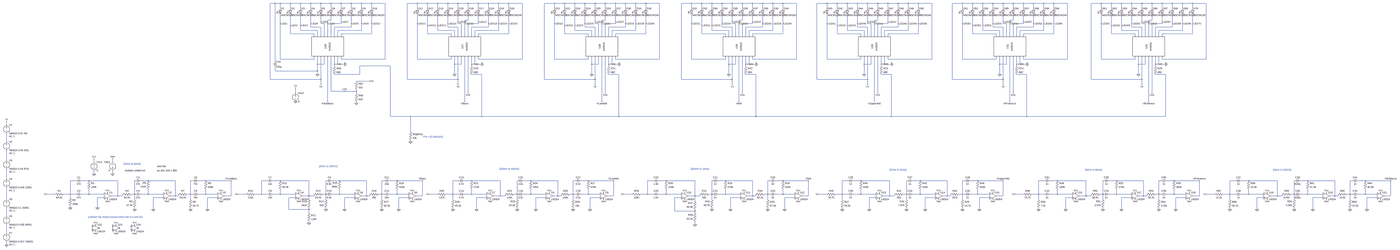
[diagram p0: schematic Full_Visualizer.asc, whole sheet]
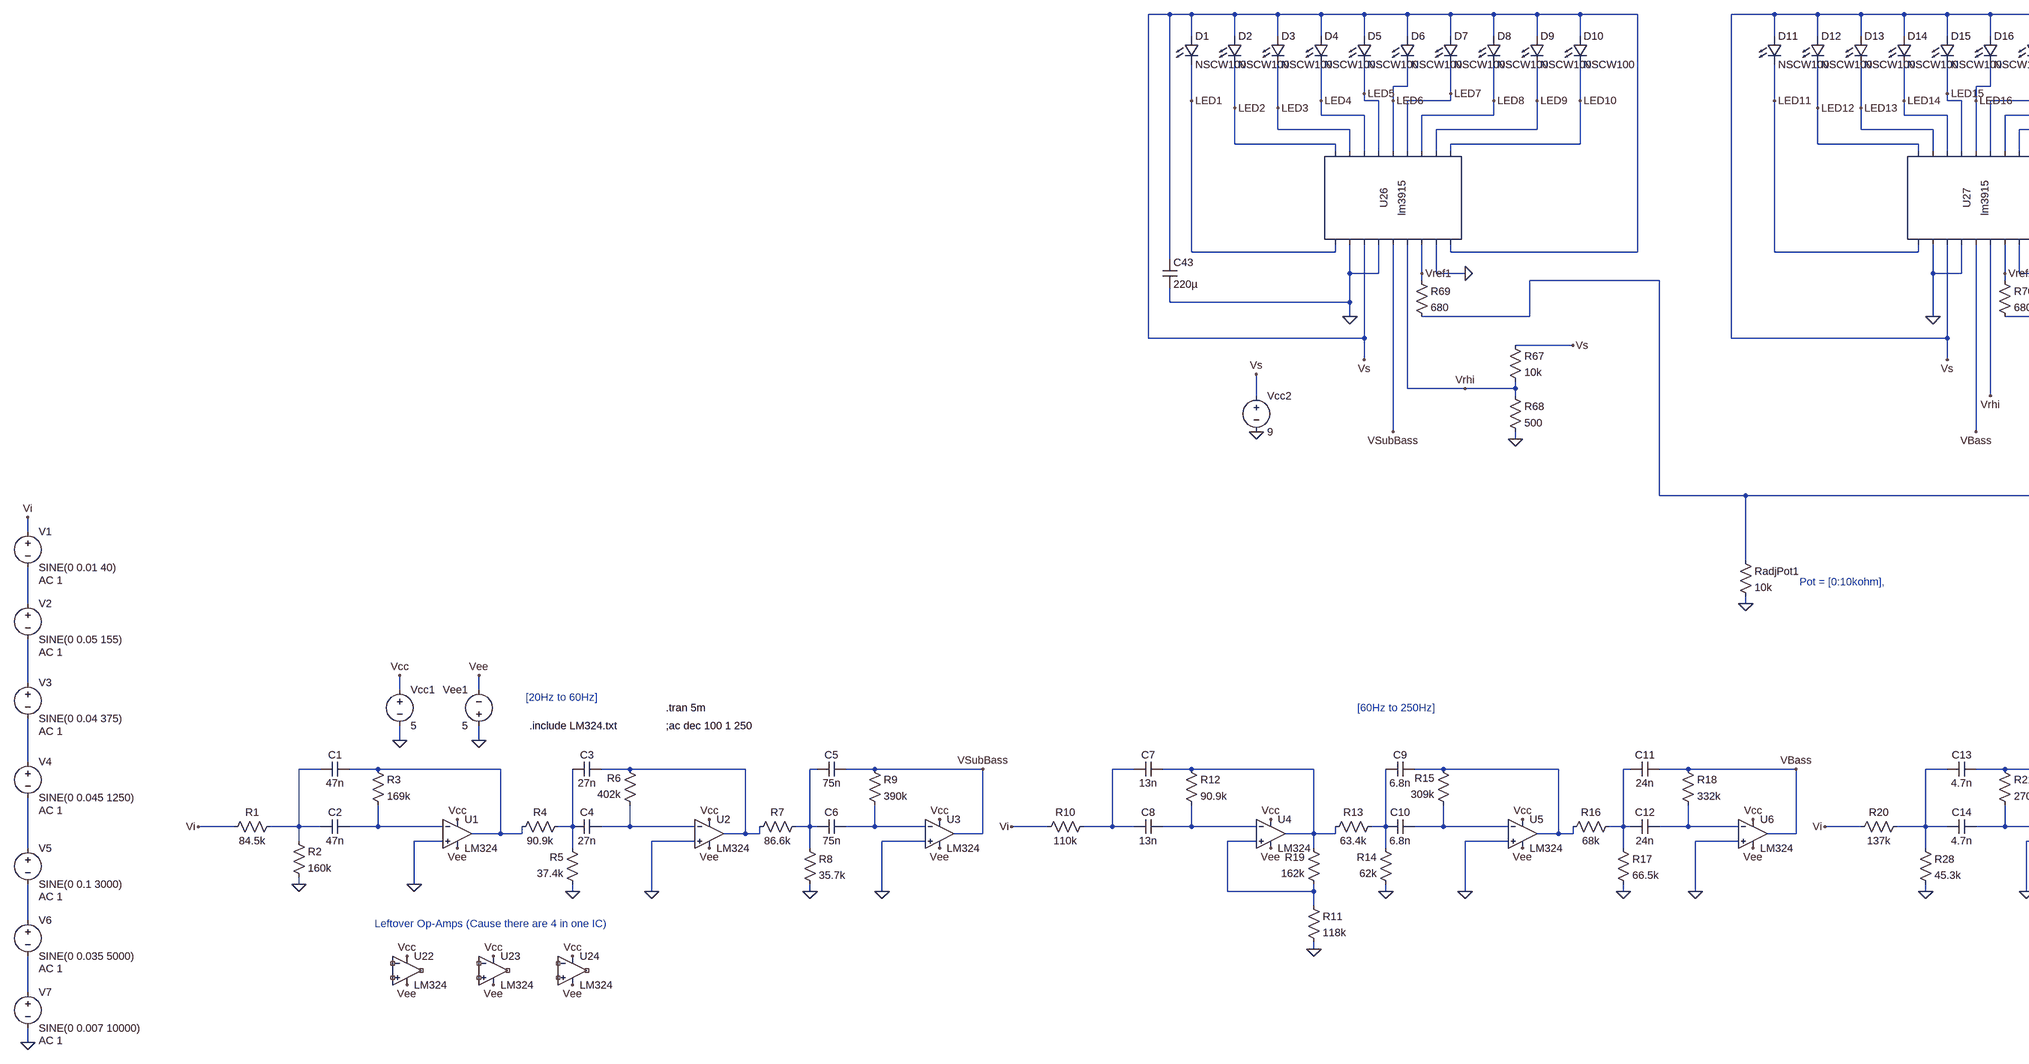
[diagram p1: schematic Full_Visualizer.asc, part, row 1 of 1, column 1 of 3]
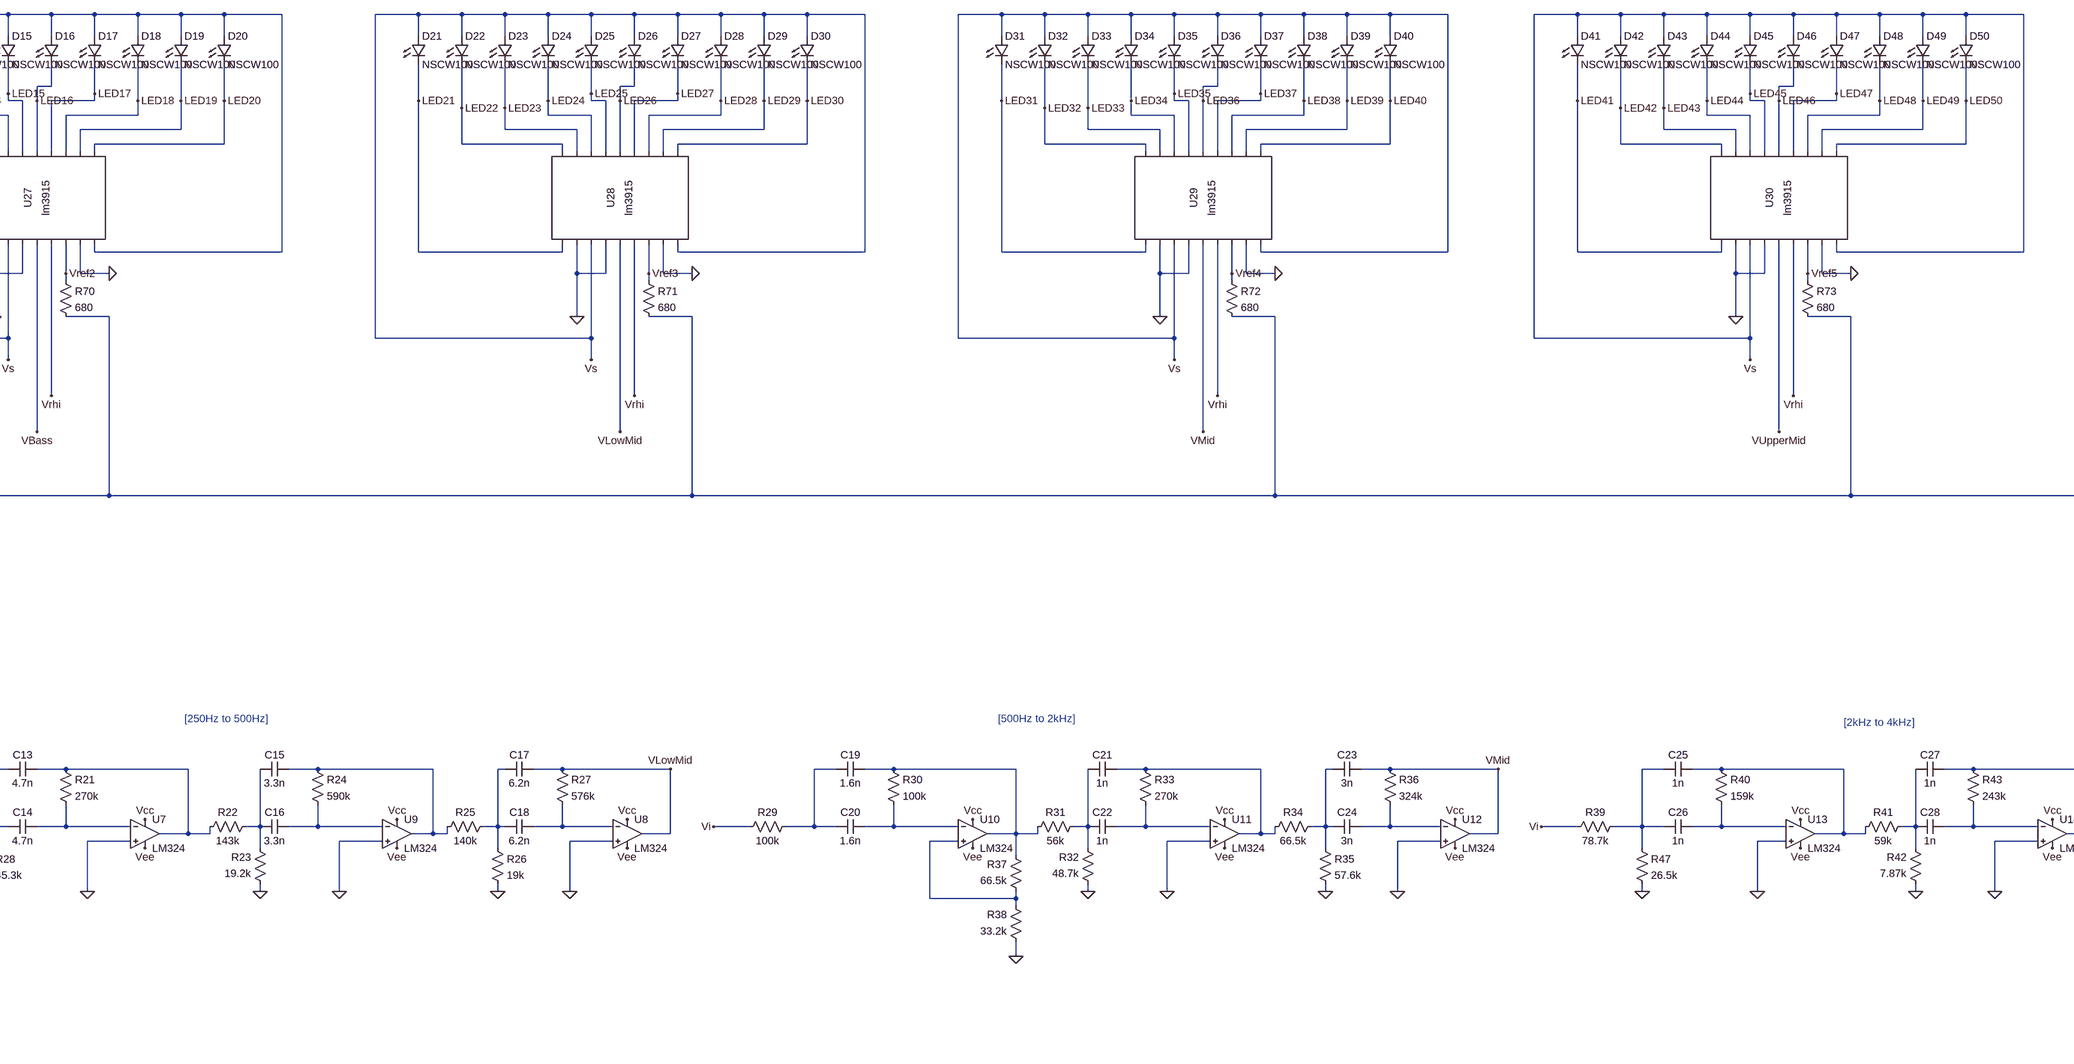
[diagram p2: schematic Full_Visualizer.asc, part, row 1 of 1, column 2 of 3]
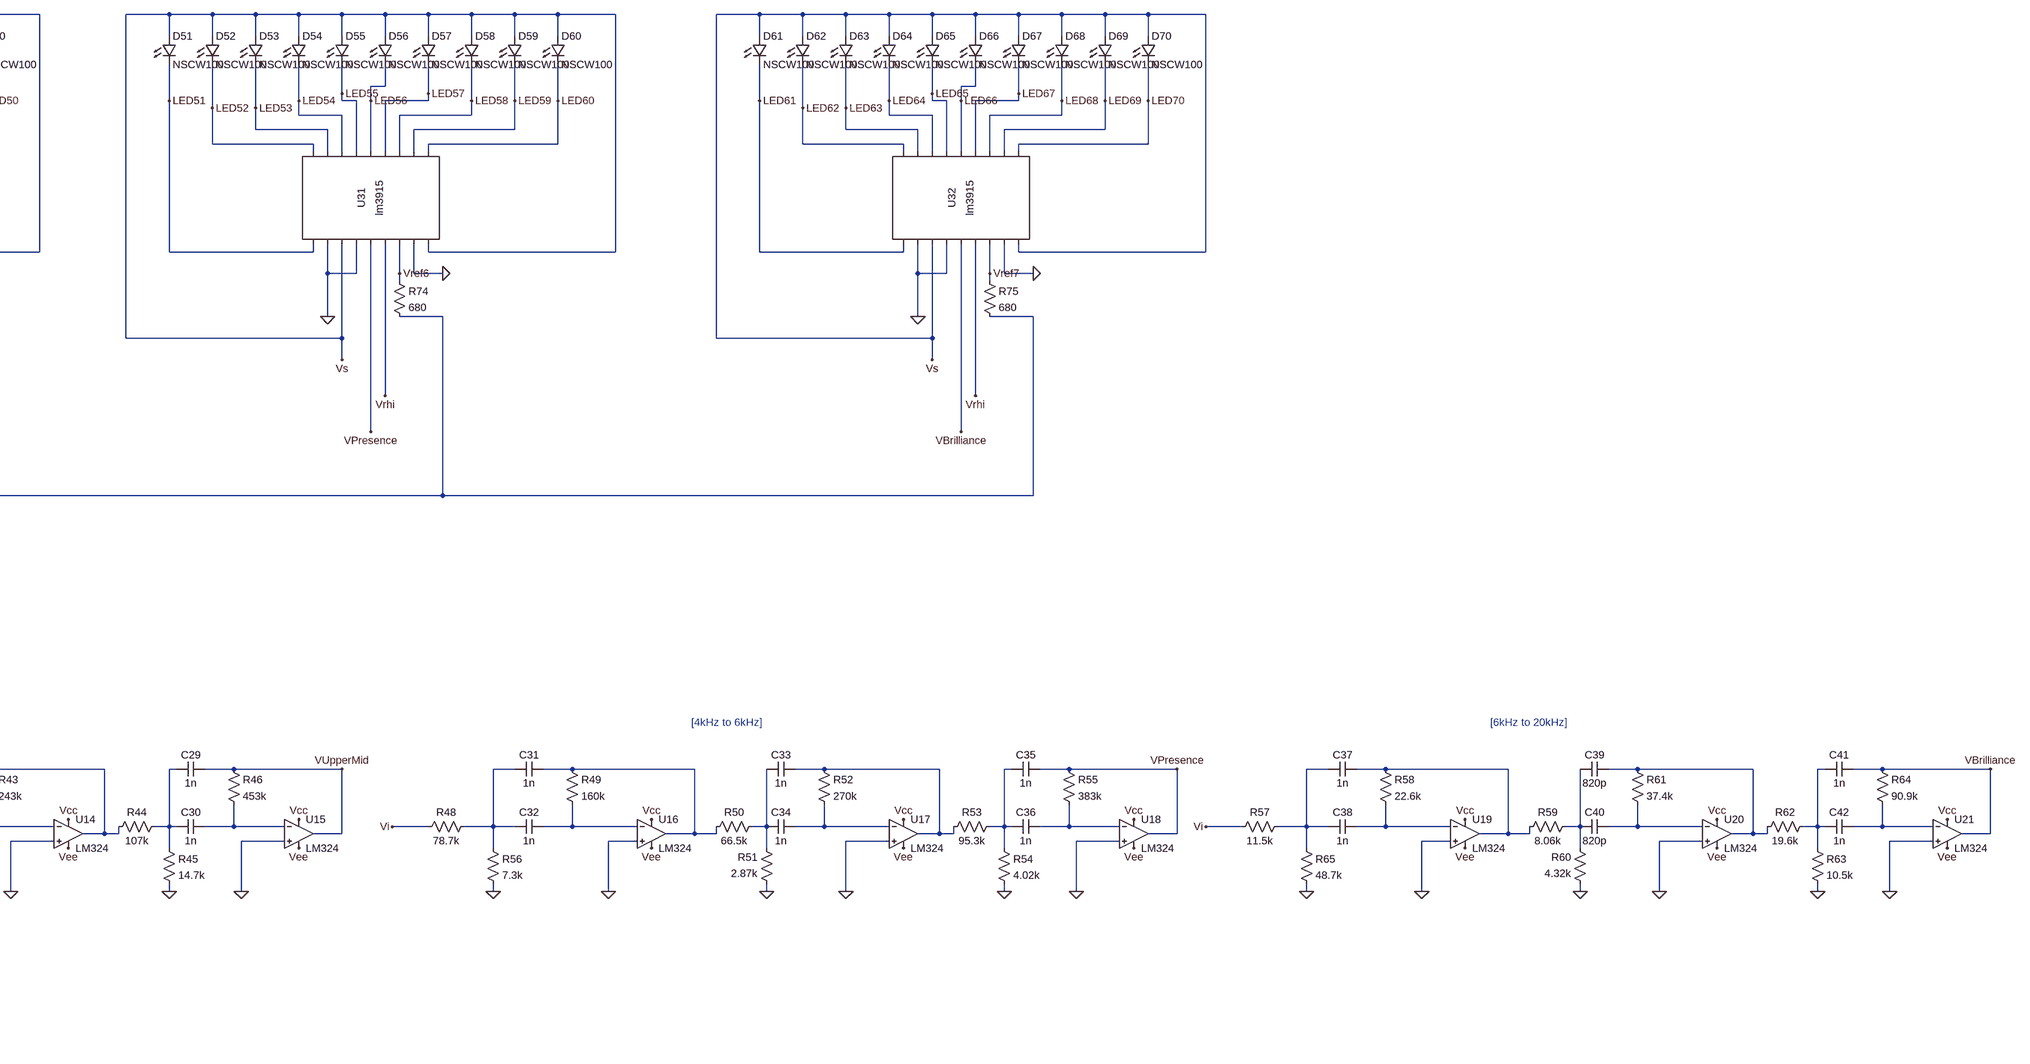
[diagram p3: schematic Full_Visualizer.asc, part, row 1 of 1, column 3 of 3]
* Full_Visualizer.asc
R1 N005 Vi 84.5k
V1 Vi N002 SINE(0 0.01 40) AC 1
R2 N005 0 160k
R3 N006 N033 169k
R4 N034 N006 90.9k
R5 0 N034 37.4k
R6 N035 N007 402k
R7 N007 N008 86.6k
R8 N008 0 35.7k
R9 VSubBass N036 390k
C1 N006 N005 47n
C2 N033 N005 47n
C3 N007 N034 27n
C4 N035 N034 27n
C5 VSubBass N008 75n
C6 N036 N008 75n
XU1 0 N033 Vcc Vee N006 LM324  ; pins In+ In- V+ V- OUT
XU2 0 N035 Vcc Vee N007 LM324  ; pins In+ In- V+ V- OUT
XU3 0 N036 Vcc Vee VSubBass LM324  ; pins In+ In- V+ V- OUT
Vcc1 Vcc 0 5
Vee1 0 Vee 5
R10 N009 Vi 110k
V2 N002 N003 SINE(0 0.05 155) AC 1
R11 N061 0 118k
R12 N010 N037 90.9k
R13 N038 N010 63.4k
R14 0 N038 62k
R15 N039 N011 309k
R16 N011 N012 68k
R17 N012 0 66.5k
R18 VBass N040 332k
C7 N010 N009 13n
C8 N037 N009 13n
C9 N011 N038 6.8n
C10 N039 N038 6.8n
C11 VBass N012 24n
C12 N040 N012 24n
R19 N061 N010 162k
XU4 N061 N037 Vcc Vee N010 LM324  ; pins In+ In- V+ V- OUT
XU5 0 N039 Vcc Vee N011 LM324  ; pins In+ In- V+ V- OUT
XU6 0 N040 Vcc Vee VBass LM324  ; pins In+ In- V+ V- OUT
R20 N013 Vi 137k
V3 N003 N004 SINE(0 0.04 375) AC 1
R21 N014 N041 270k
R22 N042 N014 143k
R23 0 N042 19.2k
R24 N015 N043 590k
R25 N015 N016 140k
R26 N016 0 19k
R27 VLowMid N044 576k
C13 N014 N013 4.7n
C14 N041 N013 4.7n
C15 N015 N042 3.3n
C16 N043 N042 3.3n
C17 VLowMid N016 6.2n
C18 N044 N016 6.2n
R28 N013 0 45.3k
XU7 0 N041 Vcc Vee N014 LM324  ; pins In+ In- V+ V- OUT
XU8 0 N044 Vcc Vee VLowMid LM324  ; pins In+ In- V+ V- OUT
XU9 0 N043 Vcc Vee N015 LM324  ; pins In+ In- V+ V- OUT
R29 N017 Vi 100k
V4 N004 N063 SINE(0 0.045 1250) AC 1
R30 N018 N045 100k
R31 N046 N018 56k
R32 0 N046 48.7k
R33 N019 N047 270k
R34 N019 N020 66.5k
R35 N020 0 57.6k
R36 VMid N048 324k
C19 N018 N017 1.6n
C20 N045 N017 1.6n
C21 N019 N046 1n
C22 N047 N046 1n
C23 VMid N020 3n
C24 N048 N020 3n
R37 N062 N018 66.5k
R38 0 N062 33.2k
XU10 N062 N045 Vcc Vee N018 LM324  ; pins In+ In- V+ V- OUT
XU11 0 N047 Vcc Vee N019 LM324  ; pins In+ In- V+ V- OUT
XU12 0 N048 Vcc Vee VMid LM324  ; pins In+ In- V+ V- OUT
R39 N021 Vi 78.7k
V5 N063 N064 SINE(0 0.1 3000) AC 1
R40 N022 N049 159k
R41 N050 N022 59k
R42 0 N050 7.87k
R43 N023 N051 243k
R44 N023 N024 107k
R45 N024 0 14.7k
R46 VUpperMid N052 453k
C25 N022 N021 1n
C26 N049 N021 1n
C27 N023 N050 1n
C28 N051 N050 1n
C29 VUpperMid N024 1n
C30 N052 N024 1n
R47 N021 0 26.5k
XU13 0 N049 Vcc Vee N022 LM324  ; pins In+ In- V+ V- OUT
XU14 0 N051 Vcc Vee N023 LM324  ; pins In+ In- V+ V- OUT
XU15 0 N052 Vcc Vee VUpperMid LM324  ; pins In+ In- V+ V- OUT
R48 N025 Vi 78.7k
V6 N064 N065 SINE(0 0.035 5000) AC 1
R49 N026 N053 160k
R50 N054 N026 66.5k
R51 0 N054 2.87k
R52 N027 N055 270k
R53 N027 N028 95.3k
R54 N028 0 4.02k
R55 VPresence N056 383k
C31 N026 N025 1n
C32 N053 N025 1n
C33 N027 N054 1n
C34 N055 N054 1n
C35 VPresence N028 1n
C36 N056 N028 1n
R56 N025 0 7.3k
XU16 0 N053 Vcc Vee N026 LM324  ; pins In+ In- V+ V- OUT
XU17 0 N055 Vcc Vee N027 LM324  ; pins In+ In- V+ V- OUT
XU18 0 N056 Vcc Vee VPresence LM324  ; pins In+ In- V+ V- OUT
R57 N029 Vi 11.5k
V7 N065 0 SINE(0 0.007 10000) AC 1
R58 N030 N057 22.6k
R59 N058 N030 8.06k
R60 0 N058 4.32k
R61 N031 N059 37.4k
R62 N031 N032 19.6k
R63 N032 0 10.5k
R64 VBrilliance N060 90.9k
C37 N030 N029 1n
C38 N057 N029 1n
C39 N031 N058 820p
C40 N059 N058 820p
C41 VBrilliance N032 1n
C42 N060 N032 1n
R65 N029 0 48.7k
XU19 0 N057 Vcc Vee N030 LM324  ; pins In+ In- V+ V- OUT
XU20 0 N059 Vcc Vee N031 LM324  ; pins In+ In- V+ V- OUT
XU21 0 N060 Vcc Vee VBrilliance LM324  ; pins In+ In- V+ V- OUT
XU22 NC_01 NC_02 Vcc Vee NC_03 LM324  ; pins In+ In- V+ V- OUT
XU23 NC_04 NC_05 Vcc Vee NC_06 LM324  ; pins In+ In- V+ V- OUT
XU24 NC_07 NC_08 Vcc Vee NC_09 LM324  ; pins In+ In- V+ V- OUT
D1 Vs LED1 NSCW100
D2 Vs LED2 NSCW100
D3 Vs LED3 NSCW100
D4 Vs LED4 NSCW100
D5 Vs LED5 NSCW100
D6 Vs LED6 NSCW100
D7 Vs LED7 NSCW100
D8 Vs LED8 NSCW100
D9 Vs LED9 NSCW100
D10 Vs LED10 NSCW100
C43 Vs 0 220µ
Vcc2 Vs 0 9
* U26: lm3915 (symbol AutoGenerated\lm3915 not available, pins judged from their places): pin1=LED1 pin2=0 pin3=Vs pin4=0 pin5=VSubBass pin6=Vrhi pin7=Vref1 pin8=0 pin9=Vs pin10=LED2 pin11=LED3 pin12=LED4 pin13=LED5 pin14=LED6 pin15=LED7 pin16=LED8 pin17=LED9 pin18=LED10
R67 Vs Vrhi 10k
R68 Vrhi 0 500
R69 Vref1 N001 680
D12 Vs LED12 NSCW100
D13 Vs LED13 NSCW100
D14 Vs LED14 NSCW100
D15 Vs LED15 NSCW100
D16 Vs LED16 NSCW100
D17 Vs LED17 NSCW100
D18 Vs LED18 NSCW100
D19 Vs LED19 NSCW100
D20 Vs LED20 NSCW100
* U27: lm3915 (symbol AutoGenerated\lm3915 not available, pins judged from their places): pin1=LED11 pin2=0 pin3=Vs pin4=0 pin5=VBass pin6=Vrhi pin7=Vref2 pin8=0 pin9=Vs pin10=LED12 pin11=LED13 pin12=LED14 pin13=LED15 pin14=LED16 pin15=LED17 pin16=LED18 pin17=LED19 pin18=LED20
R70 Vref2 N001 680
D22 Vs LED22 NSCW100
D23 Vs LED23 NSCW100
D24 Vs LED24 NSCW100
D25 Vs LED25 NSCW100
D26 Vs LED26 NSCW100
D27 Vs LED27 NSCW100
D28 Vs LED28 NSCW100
D29 Vs LED29 NSCW100
D30 Vs LED30 NSCW100
* U28: lm3915 (symbol AutoGenerated\lm3915 not available, pins judged from their places): pin1=LED21 pin2=0 pin3=Vs pin4=0 pin5=VLowMid pin6=Vrhi pin7=Vref3 pin8=0 pin9=Vs pin10=LED22 pin11=LED23 pin12=LED24 pin13=LED25 pin14=LED26 pin15=LED27 pin16=LED28 pin17=LED29 pin18=LED30
R71 Vref3 N001 680
D32 Vs LED32 NSCW100
D33 Vs LED33 NSCW100
D34 Vs LED34 NSCW100
D35 Vs LED35 NSCW100
D36 Vs LED36 NSCW100
D37 Vs LED37 NSCW100
D38 Vs LED38 NSCW100
D39 Vs LED39 NSCW100
D40 Vs LED40 NSCW100
* U29: lm3915 (symbol AutoGenerated\lm3915 not available, pins judged from their places): pin1=LED31 pin2=0 pin3=Vs pin4=0 pin5=VMid pin6=Vrhi pin7=Vref4 pin8=0 pin9=Vs pin10=LED32 pin11=LED33 pin12=LED34 pin13=LED35 pin14=LED36 pin15=LED37 pin16=LED38 pin17=LED39 pin18=LED40
R72 Vref4 N001 680
D42 Vs LED42 NSCW100
D43 Vs LED43 NSCW100
D44 Vs LED44 NSCW100
D45 Vs LED45 NSCW100
D46 Vs LED46 NSCW100
D47 Vs LED47 NSCW100
D48 Vs LED48 NSCW100
D49 Vs LED49 NSCW100
D50 Vs LED50 NSCW100
* U30: lm3915 (symbol AutoGenerated\lm3915 not available, pins judged from their places): pin1=LED41 pin2=0 pin3=Vs pin4=0 pin5=VUpperMid pin6=Vrhi pin7=Vref5 pin8=0 pin9=Vs pin10=LED42 pin11=LED43 pin12=LED44 pin13=LED45 pin14=LED46 pin15=LED47 pin16=LED48 pin17=LED49 pin18=LED50
R73 Vref5 N001 680
D52 Vs LED52 NSCW100
D53 Vs LED53 NSCW100
D54 Vs LED54 NSCW100
D55 Vs LED55 NSCW100
D56 Vs LED56 NSCW100
D57 Vs LED57 NSCW100
D58 Vs LED58 NSCW100
D59 Vs LED59 NSCW100
D60 Vs LED60 NSCW100
* U31: lm3915 (symbol AutoGenerated\lm3915 not available, pins judged from their places): pin1=LED51 pin2=0 pin3=Vs pin4=0 pin5=VPresence pin6=Vrhi pin7=Vref6 pin8=0 pin9=Vs pin10=LED52 pin11=LED53 pin12=LED54 pin13=LED55 pin14=LED56 pin15=LED57 pin16=LED58 pin17=LED59 pin18=LED60
R74 Vref6 N001 680
D62 Vs LED62 NSCW100
D63 Vs LED63 NSCW100
D64 Vs LED64 NSCW100
D65 Vs LED65 NSCW100
D66 Vs LED66 NSCW100
D67 Vs LED67 NSCW100
D68 Vs LED68 NSCW100
D69 Vs LED69 NSCW100
D70 Vs LED70 NSCW100
* U32: lm3915 (symbol AutoGenerated\lm3915 not available, pins judged from their places): pin1=LED61 pin2=0 pin3=Vs pin4=0 pin5=VBrilliance pin6=Vrhi pin7=Vref7 pin8=0 pin9=Vs pin10=LED62 pin11=LED63 pin12=LED64 pin13=LED65 pin14=LED66 pin15=LED67 pin16=LED68 pin17=LED69 pin18=LED70
R75 Vref7 N001 680
RadjPot1 N001 0 10k
D11 Vs LED11 NSCW100
D21 Vs LED21 NSCW100
D31 Vs LED31 NSCW100
D41 Vs LED41 NSCW100
D51 Vs LED51 NSCW100
D61 Vs LED61 NSCW100
.model D D
.lib standard.dio
.tran 5m
;ac dec 100 1 250
* [20Hz to 60Hz]
.include LM324.txt
* [60Hz to 250Hz]
* [250Hz to 500Hz]
* [500Hz to 2kHz]
* [2kHz to 4kHz]
* [4kHz to 6kHz]
* [6kHz to 20kHz]
* Leftover Op-Amps (Cause there are 4 in one IC)
* Pot = [0:10kohm],
.backanno
.end